# EAGLE schematic ARE_moduls (EAGLE 6.1)

## Sheet 1 of 6: Motor Pololu encoder/driver
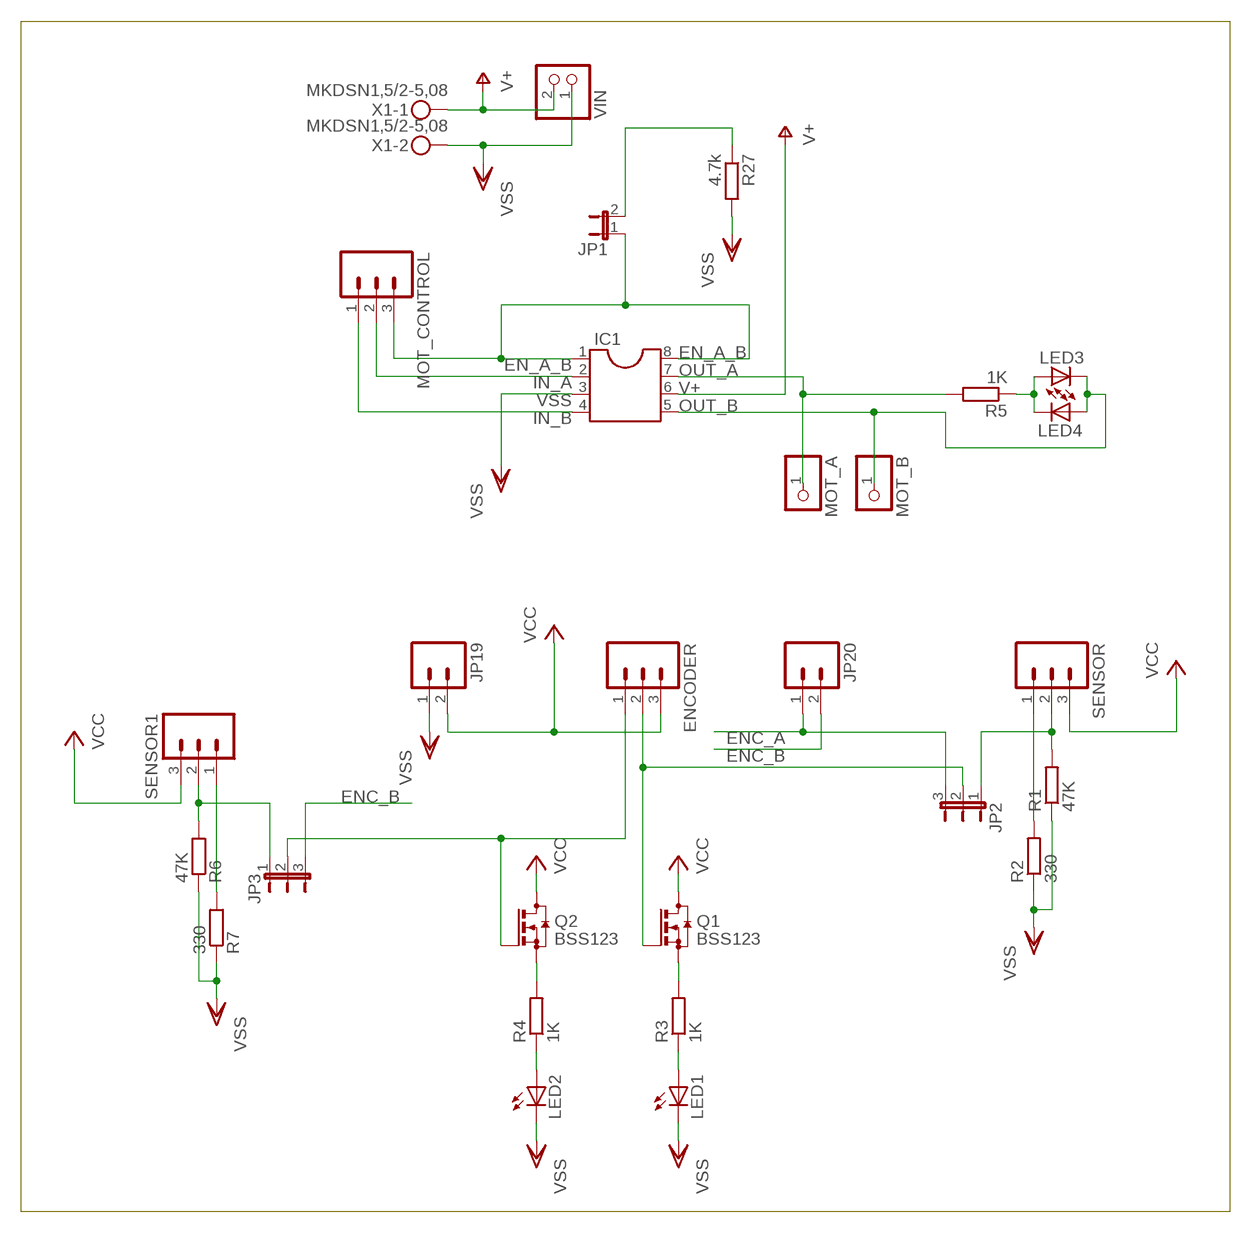
[diagram p0: schematic, sheet 1]

### Parts
ENCODER  M03PTH  [1X03]
IC1  DIL8S  [SOCKET-08]
JP1  JP1E  [JP1]
JP2  JP2E  [JP2]
JP3  JP2E  [JP2]
JP19  M02PTH  [1X02]
JP20  M02PTH  [1X02]
LED1  LEDCHIPLED_0805  [CHIPLED_0805]
LED2  LEDCHIPLED_0805  [CHIPLED_0805]
LED3  LEDCHIPLED_0805  [CHIPLED_0805]
LED4  LEDCHIPLED_0805  [CHIPLED_0805]
MOT_A  PINHD-1X1  [1X01]
MOT_B  PINHD-1X1  [1X01]
MOT_CONTROL  M03PTH  [1X03]
Q1  BSS123  [SOT23]
Q2  BSS123  [SOT23]
R1  47K  R-EU_M0805  [M0805]
R2  330  R-EU_M0805  [M0805]
R3  1K  R-EU_M0805  [M0805]
R4  1K  R-EU_M0805  [M0805]
R5  1K  R-EU_M0805  [M0805]
R6  47K  R-EU_M0805  [M0805]
R7  330  R-EU_M0805  [M0805]
R27  4.7k  R-EU_R0805  [R0805]
SENSOR  M03PTH  [1X03]
SENSOR1  M03PTH  [1X03]
VIN  PINHD-1X2  [1X02]
X1  MKDSN1,5/2-5,08  [MKDSN1,5/2-5,08]

### Nets
EN_A_B: IC1.1 IC1.8 JP1.1 MOT_CONTROL.3
ENC_A: JP2.3 JP20.1
ENC_B: JP3.3 JP20.2
IN_A: IC1.2 MOT_CONTROL.2
IN_B: IC1.4 MOT_CONTROL.1
N$1: JP1.2 R27.1
N$2: R2.2 SENSOR.1
N$3: ENCODER.2 JP2.2 Q1.1(G)
N$4: JP2.1 R1.2 SENSOR.2
N$5: Q1.2(S) R3.2
N$6: LED1.A R3.1
N$7: Q2.2(S) R4.2
N$8: LED2.A R4.1
N$9: LED3.A LED4.C R5.1
N$11: R7.2 SENSOR1.1
N$12: JP3.1 R6.2 SENSOR1.2
N$13: ENCODER.1 JP3.2 Q2.1(G)
OUT_A: IC1.7 MOT_A.1 R5.2
OUT_B: IC1.5 LED3.C LED4.A MOT_B.1
V+: IC1.6 VIN.2 X1.1
VCC: ENCODER.3 JP19.2 Q1.3(D) Q2.3(D) SENSOR1.3 SENSOR.3 ; also sheet 4
VSS: IC1.3 JP19.1 LED1.C LED2.C R1.1 R2.1 R6.1 R7.1 R27.2 VIN.1 X1.2 ; also sheet 2,3,4,5,6

## Sheet 2 of 6: 4x 16 led
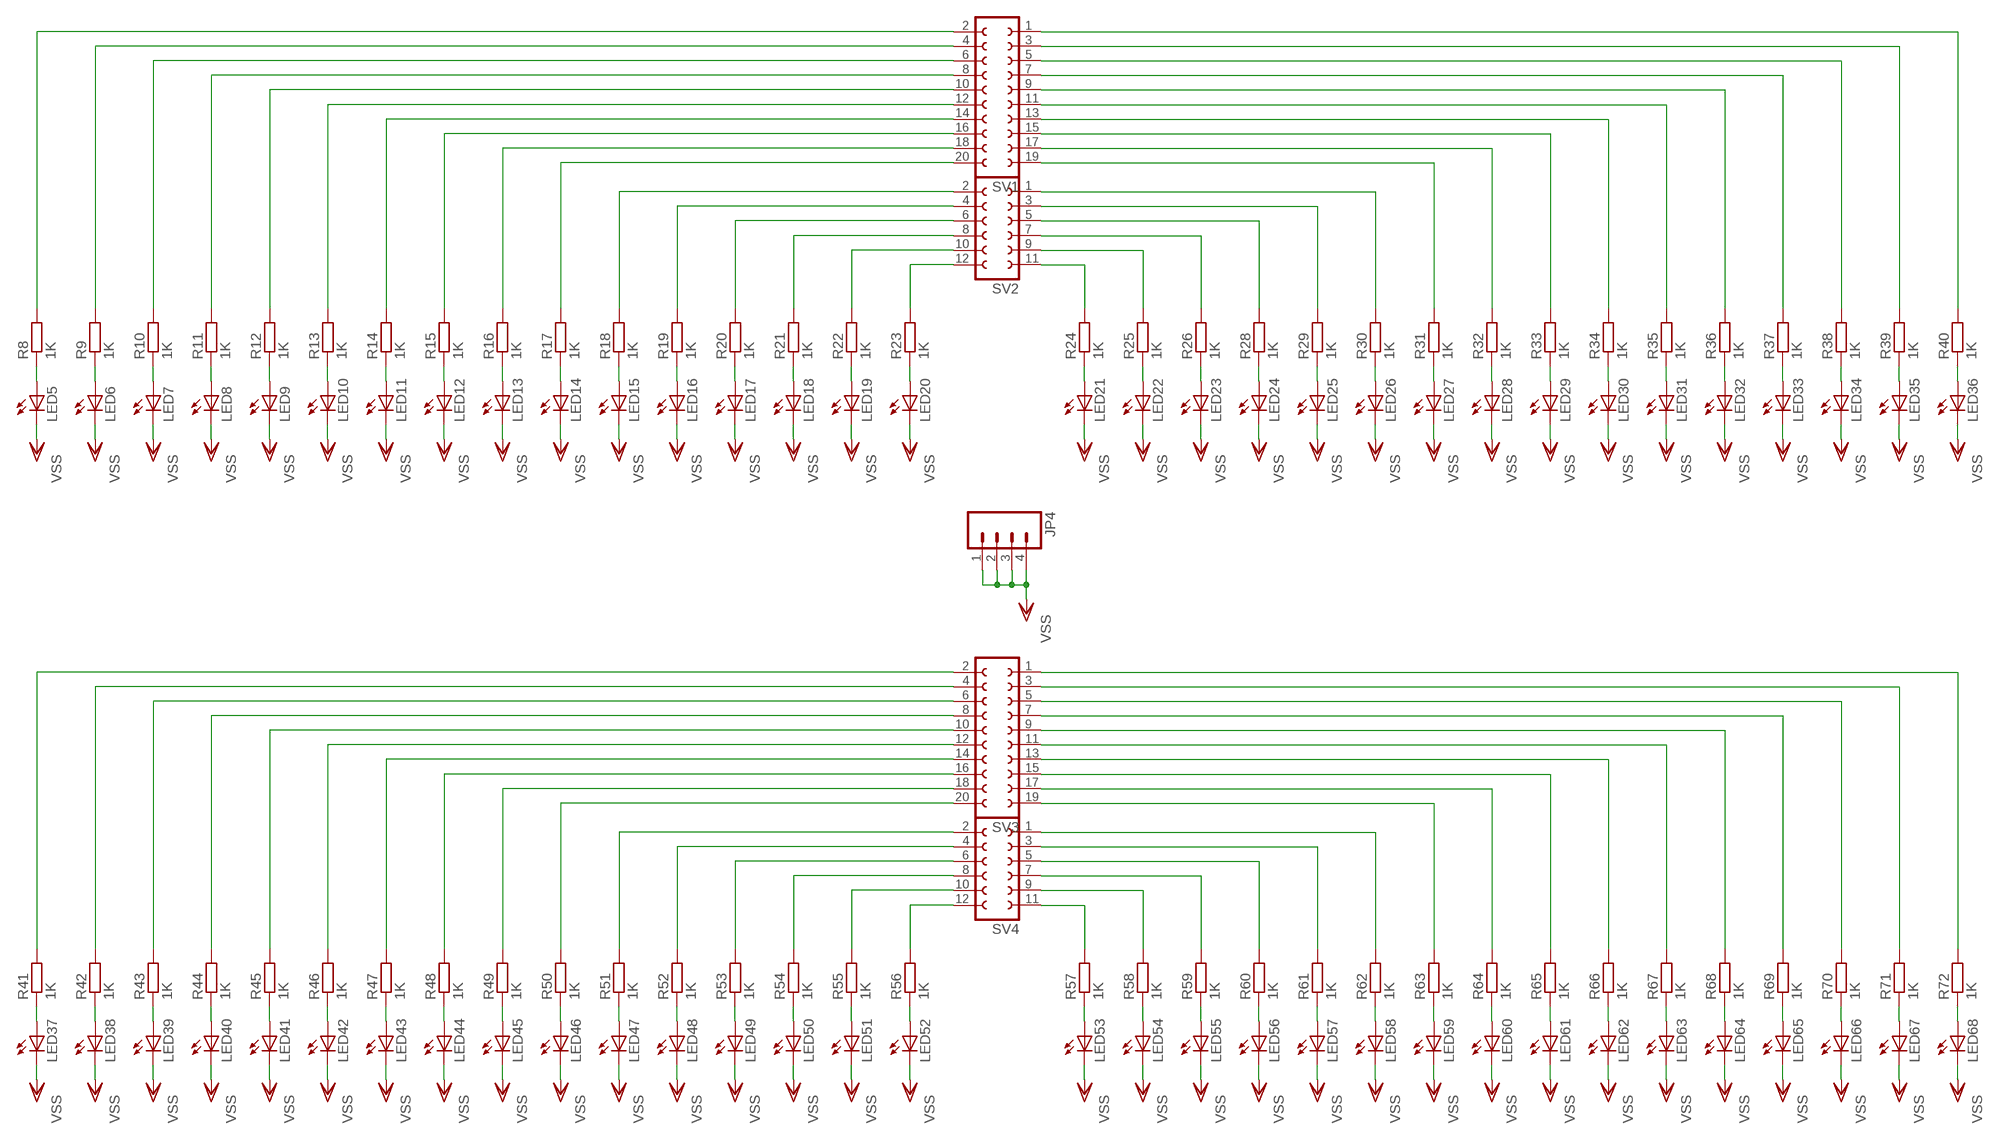
[diagram p1: schematic, sheet 2]

### Parts
JP4  M04PTH  [1X04]
LED5  LEDCHIPLED_0805  [CHIPLED_0805]
LED6  LEDCHIPLED_0805  [CHIPLED_0805]
LED7  LEDCHIPLED_0805  [CHIPLED_0805]
LED8  LEDCHIPLED_0805  [CHIPLED_0805]
LED9  LEDCHIPLED_0805  [CHIPLED_0805]
LED10  LEDCHIPLED_0805  [CHIPLED_0805]
LED11  LEDCHIPLED_0805  [CHIPLED_0805]
LED12  LEDCHIPLED_0805  [CHIPLED_0805]
LED13  LEDCHIPLED_0805  [CHIPLED_0805]
LED14  LEDCHIPLED_0805  [CHIPLED_0805]
LED15  LEDCHIPLED_0805  [CHIPLED_0805]
LED16  LEDCHIPLED_0805  [CHIPLED_0805]
LED17  LEDCHIPLED_0805  [CHIPLED_0805]
LED18  LEDCHIPLED_0805  [CHIPLED_0805]
LED19  LEDCHIPLED_0805  [CHIPLED_0805]
LED20  LEDCHIPLED_0805  [CHIPLED_0805]
LED21  LEDCHIPLED_0805  [CHIPLED_0805]
LED22  LEDCHIPLED_0805  [CHIPLED_0805]
LED23  LEDCHIPLED_0805  [CHIPLED_0805]
LED24  LEDCHIPLED_0805  [CHIPLED_0805]
LED25  LEDCHIPLED_0805  [CHIPLED_0805]
LED26  LEDCHIPLED_0805  [CHIPLED_0805]
LED27  LEDCHIPLED_0805  [CHIPLED_0805]
LED28  LEDCHIPLED_0805  [CHIPLED_0805]
LED29  LEDCHIPLED_0805  [CHIPLED_0805]
LED30  LEDCHIPLED_0805  [CHIPLED_0805]
LED31  LEDCHIPLED_0805  [CHIPLED_0805]
LED32  LEDCHIPLED_0805  [CHIPLED_0805]
LED33  LEDCHIPLED_0805  [CHIPLED_0805]
LED34  LEDCHIPLED_0805  [CHIPLED_0805]
LED35  LEDCHIPLED_0805  [CHIPLED_0805]
LED36  LEDCHIPLED_0805  [CHIPLED_0805]
LED37  LEDCHIPLED_0805  [CHIPLED_0805]
LED38  LEDCHIPLED_0805  [CHIPLED_0805]
LED39  LEDCHIPLED_0805  [CHIPLED_0805]
LED40  LEDCHIPLED_0805  [CHIPLED_0805]
LED41  LEDCHIPLED_0805  [CHIPLED_0805]
LED42  LEDCHIPLED_0805  [CHIPLED_0805]
LED43  LEDCHIPLED_0805  [CHIPLED_0805]
LED44  LEDCHIPLED_0805  [CHIPLED_0805]
LED45  LEDCHIPLED_0805  [CHIPLED_0805]
LED46  LEDCHIPLED_0805  [CHIPLED_0805]
LED47  LEDCHIPLED_0805  [CHIPLED_0805]
LED48  LEDCHIPLED_0805  [CHIPLED_0805]
LED49  LEDCHIPLED_0805  [CHIPLED_0805]
LED50  LEDCHIPLED_0805  [CHIPLED_0805]
LED51  LEDCHIPLED_0805  [CHIPLED_0805]
LED52  LEDCHIPLED_0805  [CHIPLED_0805]
LED53  LEDCHIPLED_0805  [CHIPLED_0805]
LED54  LEDCHIPLED_0805  [CHIPLED_0805]
LED55  LEDCHIPLED_0805  [CHIPLED_0805]
LED56  LEDCHIPLED_0805  [CHIPLED_0805]
LED57  LEDCHIPLED_0805  [CHIPLED_0805]
LED58  LEDCHIPLED_0805  [CHIPLED_0805]
LED59  LEDCHIPLED_0805  [CHIPLED_0805]
LED60  LEDCHIPLED_0805  [CHIPLED_0805]
LED61  LEDCHIPLED_0805  [CHIPLED_0805]
LED62  LEDCHIPLED_0805  [CHIPLED_0805]
LED63  LEDCHIPLED_0805  [CHIPLED_0805]
LED64  LEDCHIPLED_0805  [CHIPLED_0805]
LED65  LEDCHIPLED_0805  [CHIPLED_0805]
LED66  LEDCHIPLED_0805  [CHIPLED_0805]
LED67  LEDCHIPLED_0805  [CHIPLED_0805]
LED68  LEDCHIPLED_0805  [CHIPLED_0805]
R8  1K  R-EU_M0805  [M0805]
R9  1K  R-EU_M0805  [M0805]
R10  1K  R-EU_M0805  [M0805]
R11  1K  R-EU_M0805  [M0805]
R12  1K  R-EU_M0805  [M0805]
R13  1K  R-EU_M0805  [M0805]
R14  1K  R-EU_M0805  [M0805]
R15  1K  R-EU_M0805  [M0805]
R16  1K  R-EU_M0805  [M0805]
R17  1K  R-EU_M0805  [M0805]
R18  1K  R-EU_M0805  [M0805]
R19  1K  R-EU_M0805  [M0805]
R20  1K  R-EU_M0805  [M0805]
R21  1K  R-EU_M0805  [M0805]
R22  1K  R-EU_M0805  [M0805]
R23  1K  R-EU_M0805  [M0805]
R24  1K  R-EU_M0805  [M0805]
R25  1K  R-EU_M0805  [M0805]
R26  1K  R-EU_M0805  [M0805]
R28  1K  R-EU_M0805  [M0805]
R29  1K  R-EU_M0805  [M0805]
R30  1K  R-EU_M0805  [M0805]
R31  1K  R-EU_M0805  [M0805]
R32  1K  R-EU_M0805  [M0805]
R33  1K  R-EU_M0805  [M0805]
R34  1K  R-EU_M0805  [M0805]
R35  1K  R-EU_M0805  [M0805]
R36  1K  R-EU_M0805  [M0805]
R37  1K  R-EU_M0805  [M0805]
R38  1K  R-EU_M0805  [M0805]
R39  1K  R-EU_M0805  [M0805]
R40  1K  R-EU_M0805  [M0805]
R41  1K  R-EU_M0805  [M0805]
R42  1K  R-EU_M0805  [M0805]
R43  1K  R-EU_M0805  [M0805]
R44  1K  R-EU_M0805  [M0805]
R45  1K  R-EU_M0805  [M0805]
R46  1K  R-EU_M0805  [M0805]
R47  1K  R-EU_M0805  [M0805]
R48  1K  R-EU_M0805  [M0805]
R49  1K  R-EU_M0805  [M0805]
R50  1K  R-EU_M0805  [M0805]
R51  1K  R-EU_M0805  [M0805]
R52  1K  R-EU_M0805  [M0805]
R53  1K  R-EU_M0805  [M0805]
R54  1K  R-EU_M0805  [M0805]
R55  1K  R-EU_M0805  [M0805]
R56  1K  R-EU_M0805  [M0805]
R57  1K  R-EU_M0805  [M0805]
R58  1K  R-EU_M0805  [M0805]
R59  1K  R-EU_M0805  [M0805]
R60  1K  R-EU_M0805  [M0805]
R61  1K  R-EU_M0805  [M0805]
R62  1K  R-EU_M0805  [M0805]
R63  1K  R-EU_M0805  [M0805]
R64  1K  R-EU_M0805  [M0805]
R65  1K  R-EU_M0805  [M0805]
R66  1K  R-EU_M0805  [M0805]
R67  1K  R-EU_M0805  [M0805]
R68  1K  R-EU_M0805  [M0805]
R69  1K  R-EU_M0805  [M0805]
R70  1K  R-EU_M0805  [M0805]
R71  1K  R-EU_M0805  [M0805]
R72  1K  R-EU_M0805  [M0805]
SV1  FE10-2  [FE10-2]
SV2  FE06-2  [FE06-2]
SV3  FE10-2  [FE10-2]
SV4  FE06-2  [FE06-2]

### Nets
N$14: LED5.A R8.1
N$15: LED6.A R9.1
N$16: LED7.A R10.1
N$17: LED8.A R11.1
N$18: LED9.A R12.1
N$19: LED10.A R13.1
N$20: LED11.A R14.1
N$21: LED12.A R15.1
N$22: LED13.A R16.1
N$23: LED14.A R17.1
N$24: LED15.A R18.1
N$25: LED16.A R19.1
N$26: LED17.A R20.1
N$27: LED18.A R21.1
N$28: LED19.A R22.1
N$29: LED20.A R23.1
N$30: R23.2 SV2.12
N$31: LED37.A R41.1
N$32: R22.2 SV2.10
N$33: R21.2 SV2.8
N$34: R20.2 SV2.6
N$35: R19.2 SV2.4
N$36: R18.2 SV2.2
N$37: R17.2 SV1.20
N$38: R16.2 SV1.18
N$39: R15.2 SV1.16
N$40: R14.2 SV1.14
N$41: R13.2 SV1.12
N$42: R12.2 SV1.10
N$43: R11.2 SV1.8
N$44: R10.2 SV1.6
N$45: R9.2 SV1.4
N$46: R8.2 SV1.2
N$47: LED21.A R24.1
N$48: LED22.A R25.1
N$49: LED23.A R26.1
N$50: LED24.A R28.1
N$51: LED25.A R29.1
N$52: LED26.A R30.1
N$53: LED27.A R31.1
N$54: LED28.A R32.1
N$56: LED29.A R33.1
N$57: LED30.A R34.1
N$58: LED31.A R35.1
N$59: LED32.A R36.1
N$60: LED33.A R37.1
N$61: LED34.A R38.1
N$62: LED35.A R39.1
N$63: LED36.A R40.1
N$64: R24.2 SV2.11
N$65: R25.2 SV2.9
N$66: R26.2 SV2.7
N$67: R28.2 SV2.5
N$68: R29.2 SV2.3
N$69: R30.2 SV2.1
N$70: R31.2 SV1.19
N$71: R32.2 SV1.17
N$72: R33.2 SV1.15
N$73: R34.2 SV1.13
N$74: R35.2 SV1.11
N$75: R36.2 SV1.9
N$76: R37.2 SV1.7
N$77: R38.2 SV1.5
N$78: R39.2 SV1.3
N$79: R40.2 SV1.1
N$80: LED38.A R42.1
N$81: LED39.A R43.1
N$82: LED40.A R44.1
N$83: LED41.A R45.1
N$84: LED42.A R46.1
N$85: LED43.A R47.1
N$86: LED44.A R48.1
N$87: LED45.A R49.1
N$88: LED46.A R50.1
N$89: LED47.A R51.1
N$90: LED48.A R52.1
N$91: LED49.A R53.1
N$92: LED50.A R54.1
N$93: LED51.A R55.1
N$94: LED52.A R56.1
N$95: R56.2 SV4.12
N$96: R55.2 SV4.10
N$97: R54.2 SV4.8
N$98: R53.2 SV4.6
N$99: R52.2 SV4.4
N$100: R51.2 SV4.2
N$101: R50.2 SV3.20
N$102: R49.2 SV3.18
N$103: R48.2 SV3.16
N$104: R47.2 SV3.14
N$105: R46.2 SV3.12
N$106: R45.2 SV3.10
N$107: R44.2 SV3.8
N$108: R43.2 SV3.6
N$109: R42.2 SV3.4
N$110: R41.2 SV3.2
N$111: LED53.A R57.1
N$112: LED54.A R58.1
N$113: LED55.A R59.1
N$114: LED56.A R60.1
N$115: LED57.A R61.1
N$116: LED58.A R62.1
N$117: LED59.A R63.1
N$118: LED60.A R64.1
N$119: LED61.A R65.1
N$120: LED62.A R66.1
N$121: LED63.A R67.1
N$122: LED64.A R68.1
N$123: LED65.A R69.1
N$124: LED66.A R70.1
N$125: LED67.A R71.1
N$126: LED68.A R72.1
N$127: R57.2 SV4.11
N$128: R58.2 SV4.9
N$132: R59.2 SV4.7
N$133: R60.2 SV4.5
N$134: R61.2 SV4.3
N$135: R62.2 SV4.1
N$136: R63.2 SV3.19
N$137: R64.2 SV3.17
N$138: R65.2 SV3.15
N$139: R66.2 SV3.13
N$140: R67.2 SV3.11
N$141: R68.2 SV3.9
N$142: R69.2 SV3.7
N$143: R70.2 SV3.5
N$144: R71.2 SV3.3
N$145: R72.2 SV3.1
VSS: JP4.1 JP4.2 JP4.3 JP4.4 LED5.C LED6.C LED7.C LED8.C LED9.C LED10.C LED11.C LED12.C LED13.C LED14.C LED15.C LED16.C LED17.C LED18.C LED19.C LED20.C LED21.C LED22.C LED23.C LED24.C LED25.C LED26.C LED27.C LED28.C LED29.C LED30.C LED31.C LED32.C LED33.C LED34.C LED35.C LED36.C LED37.C LED38.C LED39.C LED40.C LED41.C LED42.C LED43.C LED44.C LED45.C LED46.C LED47.C LED48.C LED49.C LED50.C LED51.C LED52.C LED53.C LED54.C LED55.C LED56.C LED57.C LED58.C LED59.C LED60.C LED61.C LED62.C LED63.C LED64.C LED65.C LED66.C LED67.C LED68.C ; also sheet 1,3,4,5,6

## Sheet 3 of 6: 3x 16 led
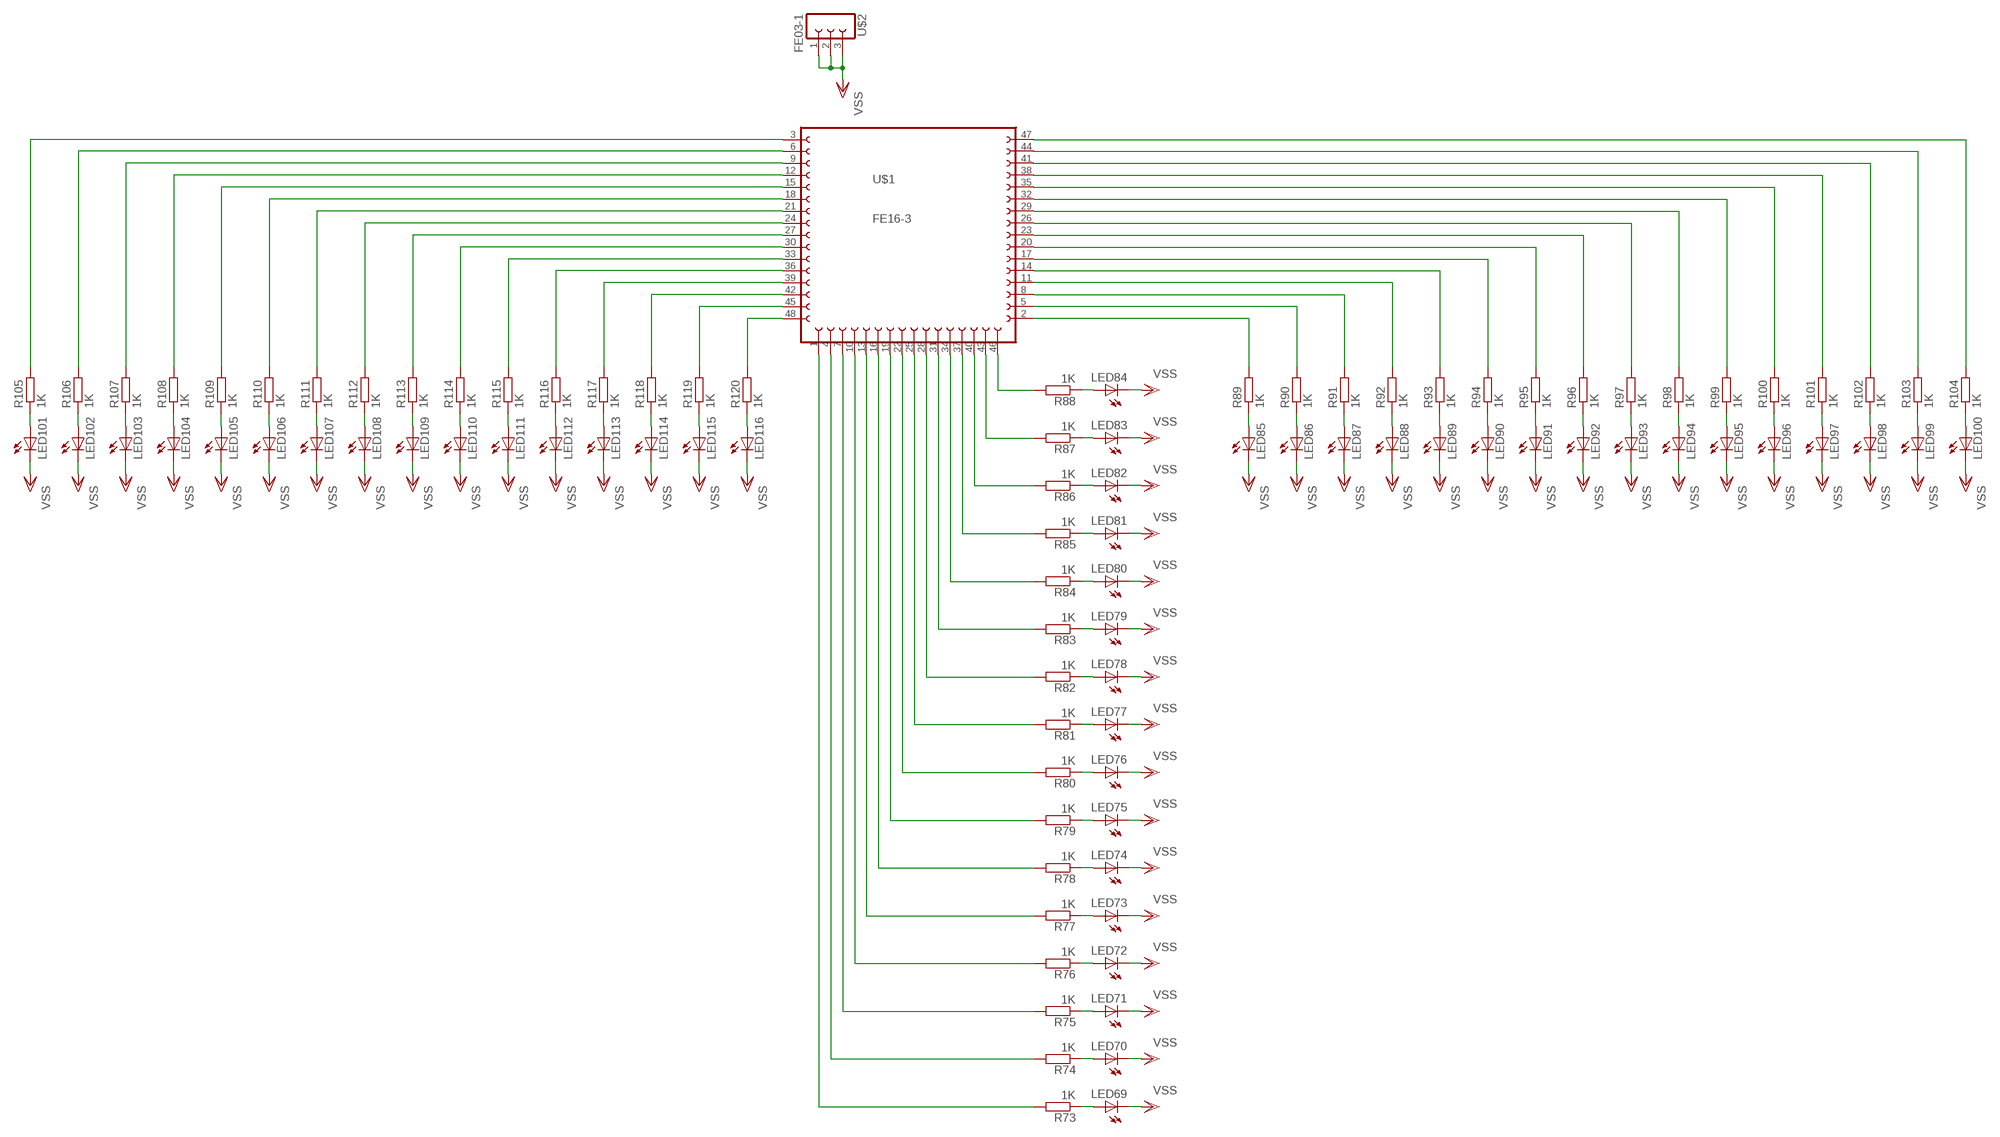
[diagram p2: schematic, sheet 3]

### Parts
LED69  LEDCHIPLED_0805  [CHIPLED_0805]
LED70  LEDCHIPLED_0805  [CHIPLED_0805]
LED71  LEDCHIPLED_0805  [CHIPLED_0805]
LED72  LEDCHIPLED_0805  [CHIPLED_0805]
LED73  LEDCHIPLED_0805  [CHIPLED_0805]
LED74  LEDCHIPLED_0805  [CHIPLED_0805]
LED75  LEDCHIPLED_0805  [CHIPLED_0805]
LED76  LEDCHIPLED_0805  [CHIPLED_0805]
LED77  LEDCHIPLED_0805  [CHIPLED_0805]
LED78  LEDCHIPLED_0805  [CHIPLED_0805]
LED79  LEDCHIPLED_0805  [CHIPLED_0805]
LED80  LEDCHIPLED_0805  [CHIPLED_0805]
LED81  LEDCHIPLED_0805  [CHIPLED_0805]
LED82  LEDCHIPLED_0805  [CHIPLED_0805]
LED83  LEDCHIPLED_0805  [CHIPLED_0805]
LED84  LEDCHIPLED_0805  [CHIPLED_0805]
LED85  LEDCHIPLED_0805  [CHIPLED_0805]
LED86  LEDCHIPLED_0805  [CHIPLED_0805]
LED87  LEDCHIPLED_0805  [CHIPLED_0805]
LED88  LEDCHIPLED_0805  [CHIPLED_0805]
LED89  LEDCHIPLED_0805  [CHIPLED_0805]
LED90  LEDCHIPLED_0805  [CHIPLED_0805]
LED91  LEDCHIPLED_0805  [CHIPLED_0805]
LED92  LEDCHIPLED_0805  [CHIPLED_0805]
LED93  LEDCHIPLED_0805  [CHIPLED_0805]
LED94  LEDCHIPLED_0805  [CHIPLED_0805]
LED95  LEDCHIPLED_0805  [CHIPLED_0805]
LED96  LEDCHIPLED_0805  [CHIPLED_0805]
LED97  LEDCHIPLED_0805  [CHIPLED_0805]
LED98  LEDCHIPLED_0805  [CHIPLED_0805]
LED99  LEDCHIPLED_0805  [CHIPLED_0805]
LED100  LEDCHIPLED_0805  [CHIPLED_0805]
LED101  LEDCHIPLED_0805  [CHIPLED_0805]
LED102  LEDCHIPLED_0805  [CHIPLED_0805]
LED103  LEDCHIPLED_0805  [CHIPLED_0805]
LED104  LEDCHIPLED_0805  [CHIPLED_0805]
LED105  LEDCHIPLED_0805  [CHIPLED_0805]
LED106  LEDCHIPLED_0805  [CHIPLED_0805]
LED107  LEDCHIPLED_0805  [CHIPLED_0805]
LED108  LEDCHIPLED_0805  [CHIPLED_0805]
LED109  LEDCHIPLED_0805  [CHIPLED_0805]
LED110  LEDCHIPLED_0805  [CHIPLED_0805]
LED111  LEDCHIPLED_0805  [CHIPLED_0805]
LED112  LEDCHIPLED_0805  [CHIPLED_0805]
LED113  LEDCHIPLED_0805  [CHIPLED_0805]
LED114  LEDCHIPLED_0805  [CHIPLED_0805]
LED115  LEDCHIPLED_0805  [CHIPLED_0805]
LED116  LEDCHIPLED_0805  [CHIPLED_0805]
R73  1K  R-EU_M0805  [M0805]
R74  1K  R-EU_M0805  [M0805]
R75  1K  R-EU_M0805  [M0805]
R76  1K  R-EU_M0805  [M0805]
R77  1K  R-EU_M0805  [M0805]
R78  1K  R-EU_M0805  [M0805]
R79  1K  R-EU_M0805  [M0805]
R80  1K  R-EU_M0805  [M0805]
R81  1K  R-EU_M0805  [M0805]
R82  1K  R-EU_M0805  [M0805]
R83  1K  R-EU_M0805  [M0805]
R84  1K  R-EU_M0805  [M0805]
R85  1K  R-EU_M0805  [M0805]
R86  1K  R-EU_M0805  [M0805]
R87  1K  R-EU_M0805  [M0805]
R88  1K  R-EU_M0805  [M0805]
R89  1K  R-EU_M0805  [M0805]
R90  1K  R-EU_M0805  [M0805]
R91  1K  R-EU_M0805  [M0805]
R92  1K  R-EU_M0805  [M0805]
R93  1K  R-EU_M0805  [M0805]
R94  1K  R-EU_M0805  [M0805]
R95  1K  R-EU_M0805  [M0805]
R96  1K  R-EU_M0805  [M0805]
R97  1K  R-EU_M0805  [M0805]
R98  1K  R-EU_M0805  [M0805]
R99  1K  R-EU_M0805  [M0805]
R100  1K  R-EU_M0805  [M0805]
R101  1K  R-EU_M0805  [M0805]
R102  1K  R-EU_M0805  [M0805]
R103  1K  R-EU_M0805  [M0805]
R104  1K  R-EU_M0805  [M0805]
R105  1K  R-EU_M0805  [M0805]
R106  1K  R-EU_M0805  [M0805]
R107  1K  R-EU_M0805  [M0805]
R108  1K  R-EU_M0805  [M0805]
R109  1K  R-EU_M0805  [M0805]
R110  1K  R-EU_M0805  [M0805]
R111  1K  R-EU_M0805  [M0805]
R112  1K  R-EU_M0805  [M0805]
R113  1K  R-EU_M0805  [M0805]
R114  1K  R-EU_M0805  [M0805]
R115  1K  R-EU_M0805  [M0805]
R116  1K  R-EU_M0805  [M0805]
R117  1K  R-EU_M0805  [M0805]
R118  1K  R-EU_M0805  [M0805]
R119  1K  R-EU_M0805  [M0805]
R120  1K  R-EU_M0805  [M0805]
U$1  FE16-3  [FE16-3]
U$2  FE03-1  [FE03-1]

### Nets
N$146: LED69.A R73.1
N$147: LED70.A R74.1
N$148: LED71.A R75.1
N$149: LED72.A R76.1
N$150: LED73.A R77.1
N$151: LED74.A R78.1
N$152: LED75.A R79.1
N$153: LED76.A R80.1
N$154: LED77.A R81.1
N$155: LED78.A R82.1
N$156: LED79.A R83.1
N$157: LED80.A R84.1
N$158: LED81.A R85.1
N$159: LED82.A R86.1
N$160: LED83.A R87.1
N$161: LED84.A R88.1
N$162: R88.2 U$1.46
N$163: R87.2 U$1.43
N$164: R86.2 U$1.40
N$165: R85.2 U$1.37
N$166: R84.2 U$1.34
N$167: R83.2 U$1.31
N$168: R82.2 U$1.28
N$169: R81.2 U$1.25
N$170: R80.2 U$1.22
N$171: R79.2 U$1.19
N$172: R78.2 U$1.16
N$173: R77.2 U$1.13
N$174: R76.2 U$1.10
N$175: R75.2 U$1.7
N$176: R74.2 U$1.4
N$177: R73.2 U$1.1
N$178: LED85.A R89.1
N$179: LED86.A R90.1
N$180: LED87.A R91.1
N$181: LED88.A R92.1
N$182: LED89.A R93.1
N$183: LED90.A R94.1
N$184: LED91.A R95.1
N$185: LED92.A R96.1
N$186: LED93.A R97.1
N$187: LED94.A R98.1
N$188: LED95.A R99.1
N$189: LED96.A R100.1
N$190: LED97.A R101.1
N$191: LED98.A R102.1
N$192: LED99.A R103.1
N$193: LED100.A R104.1
N$194: R89.2 U$1.2
N$195: R90.2 U$1.5
N$196: R91.2 U$1.8
N$197: R92.2 U$1.11
N$198: R93.2 U$1.14
N$199: R94.2 U$1.17
N$200: R95.2 U$1.20
N$201: R96.2 U$1.23
N$202: R97.2 U$1.26
N$203: R98.2 U$1.29
N$204: R99.2 U$1.32
N$205: R100.2 U$1.35
N$206: R101.2 U$1.38
N$207: R102.2 U$1.41
N$208: R103.2 U$1.44
N$209: R104.2 U$1.47
N$210: LED101.A R105.1
N$211: LED102.A R106.1
N$212: LED103.A R107.1
N$213: LED104.A R108.1
N$214: LED105.A R109.1
N$215: LED106.A R110.1
N$216: LED107.A R111.1
N$217: LED108.A R112.1
N$218: LED109.A R113.1
N$219: LED110.A R114.1
N$220: LED111.A R115.1
N$221: LED112.A R116.1
N$222: LED113.A R117.1
N$223: LED114.A R118.1
N$224: LED115.A R119.1
N$225: LED116.A R120.1
N$226: R120.2 U$1.48
N$227: R119.2 U$1.45
N$228: R118.2 U$1.42
N$229: R117.2 U$1.39
N$230: R116.2 U$1.36
N$231: R115.2 U$1.33
N$232: R114.2 U$1.30
N$233: R113.2 U$1.27
N$234: R112.2 U$1.24
N$235: R111.2 U$1.21
N$236: R110.2 U$1.18
N$237: R109.2 U$1.15
N$238: R108.2 U$1.12
N$239: R107.2 U$1.9
N$240: R106.2 U$1.6
N$241: R105.2 U$1.3
VSS: LED69.C LED70.C LED71.C LED72.C LED73.C LED74.C LED75.C LED76.C LED77.C LED78.C LED79.C LED80.C LED81.C LED82.C LED83.C LED84.C LED85.C LED86.C LED87.C LED88.C LED89.C LED90.C LED91.C LED92.C LED93.C LED94.C LED95.C LED96.C LED97.C LED98.C LED99.C LED100.C LED101.C LED102.C LED103.C LED104.C LED105.C LED106.C LED107.C LED108.C LED109.C LED110.C LED111.C LED112.C LED113.C LED114.C LED115.C LED116.C U$2.1 U$2.2 U$2.3 ; also sheet 1,2,4,5,6

## Sheet 4 of 6: 2x 16 led + 16 dip-switch
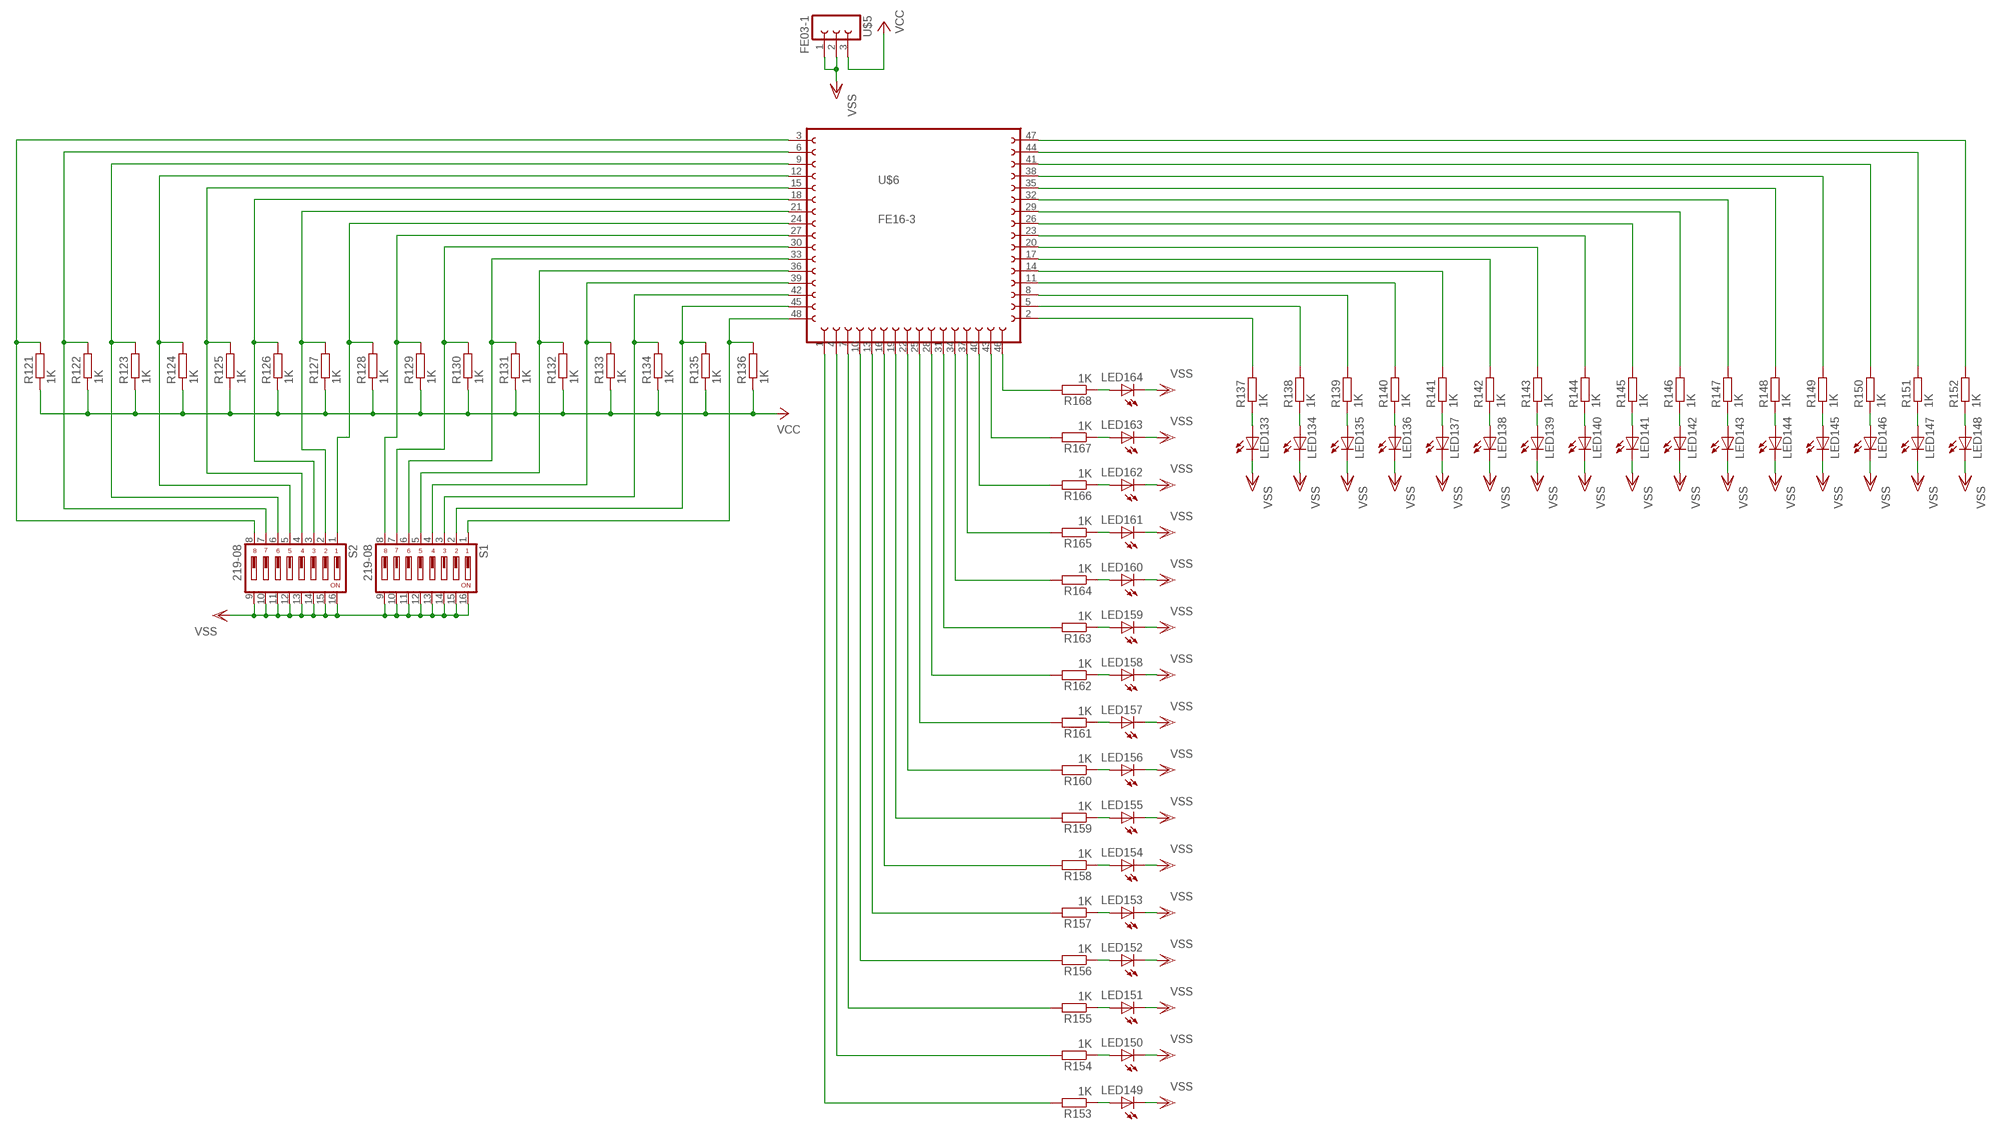
[diagram p3: schematic, sheet 4]

### Parts
LED133  LEDCHIPLED_0805  [CHIPLED_0805]
LED134  LEDCHIPLED_0805  [CHIPLED_0805]
LED135  LEDCHIPLED_0805  [CHIPLED_0805]
LED136  LEDCHIPLED_0805  [CHIPLED_0805]
LED137  LEDCHIPLED_0805  [CHIPLED_0805]
LED138  LEDCHIPLED_0805  [CHIPLED_0805]
LED139  LEDCHIPLED_0805  [CHIPLED_0805]
LED140  LEDCHIPLED_0805  [CHIPLED_0805]
LED141  LEDCHIPLED_0805  [CHIPLED_0805]
LED142  LEDCHIPLED_0805  [CHIPLED_0805]
LED143  LEDCHIPLED_0805  [CHIPLED_0805]
LED144  LEDCHIPLED_0805  [CHIPLED_0805]
LED145  LEDCHIPLED_0805  [CHIPLED_0805]
LED146  LEDCHIPLED_0805  [CHIPLED_0805]
LED147  LEDCHIPLED_0805  [CHIPLED_0805]
LED148  LEDCHIPLED_0805  [CHIPLED_0805]
LED149  LEDCHIPLED_0805  [CHIPLED_0805]
LED150  LEDCHIPLED_0805  [CHIPLED_0805]
LED151  LEDCHIPLED_0805  [CHIPLED_0805]
LED152  LEDCHIPLED_0805  [CHIPLED_0805]
LED153  LEDCHIPLED_0805  [CHIPLED_0805]
LED154  LEDCHIPLED_0805  [CHIPLED_0805]
LED155  LEDCHIPLED_0805  [CHIPLED_0805]
LED156  LEDCHIPLED_0805  [CHIPLED_0805]
LED157  LEDCHIPLED_0805  [CHIPLED_0805]
LED158  LEDCHIPLED_0805  [CHIPLED_0805]
LED159  LEDCHIPLED_0805  [CHIPLED_0805]
LED160  LEDCHIPLED_0805  [CHIPLED_0805]
LED161  LEDCHIPLED_0805  [CHIPLED_0805]
LED162  LEDCHIPLED_0805  [CHIPLED_0805]
LED163  LEDCHIPLED_0805  [CHIPLED_0805]
LED164  LEDCHIPLED_0805  [CHIPLED_0805]
R121  1K  R-EU_M0805  [M0805]
R122  1K  R-EU_M0805  [M0805]
R123  1K  R-EU_M0805  [M0805]
R124  1K  R-EU_M0805  [M0805]
R125  1K  R-EU_M0805  [M0805]
R126  1K  R-EU_M0805  [M0805]
R127  1K  R-EU_M0805  [M0805]
R128  1K  R-EU_M0805  [M0805]
R129  1K  R-EU_M0805  [M0805]
R130  1K  R-EU_M0805  [M0805]
R131  1K  R-EU_M0805  [M0805]
R132  1K  R-EU_M0805  [M0805]
R133  1K  R-EU_M0805  [M0805]
R134  1K  R-EU_M0805  [M0805]
R135  1K  R-EU_M0805  [M0805]
R136  1K  R-EU_M0805  [M0805]
R137  1K  R-EU_M0805  [M0805]
R138  1K  R-EU_M0805  [M0805]
R139  1K  R-EU_M0805  [M0805]
R140  1K  R-EU_M0805  [M0805]
R141  1K  R-EU_M0805  [M0805]
R142  1K  R-EU_M0805  [M0805]
R143  1K  R-EU_M0805  [M0805]
R144  1K  R-EU_M0805  [M0805]
R145  1K  R-EU_M0805  [M0805]
R146  1K  R-EU_M0805  [M0805]
R147  1K  R-EU_M0805  [M0805]
R148  1K  R-EU_M0805  [M0805]
R149  1K  R-EU_M0805  [M0805]
R150  1K  R-EU_M0805  [M0805]
R151  1K  R-EU_M0805  [M0805]
R152  1K  R-EU_M0805  [M0805]
R153  1K  R-EU_M0805  [M0805]
R154  1K  R-EU_M0805  [M0805]
R155  1K  R-EU_M0805  [M0805]
R156  1K  R-EU_M0805  [M0805]
R157  1K  R-EU_M0805  [M0805]
R158  1K  R-EU_M0805  [M0805]
R159  1K  R-EU_M0805  [M0805]
R160  1K  R-EU_M0805  [M0805]
R161  1K  R-EU_M0805  [M0805]
R162  1K  R-EU_M0805  [M0805]
R163  1K  R-EU_M0805  [M0805]
R164  1K  R-EU_M0805  [M0805]
R165  1K  R-EU_M0805  [M0805]
R166  1K  R-EU_M0805  [M0805]
R167  1K  R-EU_M0805  [M0805]
R168  1K  R-EU_M0805  [M0805]
S1  219-08  [CTS-219-08]
S2  219-08  [CTS-219-08]
U$5  FE03-1  [FE03-1]
U$6  FE16-3  [FE16-3]

### Nets
N$242: R135.2 S1.2 U$6.45
N$243: R136.2 S1.1 U$6.48
N$244: R134.2 S1.3 U$6.42
N$245: R133.2 S1.4 U$6.39
N$246: R132.2 S1.5 U$6.36
N$247: R131.2 S1.6 U$6.33
N$248: R130.2 S1.7 U$6.30
N$249: R129.2 S1.8 U$6.27
N$250: R128.2 S2.1 U$6.24
N$251: R127.2 S2.2 U$6.21
N$252: R126.2 S2.3 U$6.18
N$253: R125.2 S2.4 U$6.15
N$254: R124.2 S2.5 U$6.12
N$255: R123.2 S2.6 U$6.9
N$256: R122.2 S2.7 U$6.6
N$257: R121.2 S2.8 U$6.3
N$274: LED133.A R137.1
N$275: LED134.A R138.1
N$276: LED135.A R139.1
N$277: LED136.A R140.1
N$278: LED137.A R141.1
N$279: LED138.A R142.1
N$280: LED139.A R143.1
N$281: LED140.A R144.1
N$282: LED141.A R145.1
N$283: LED142.A R146.1
N$284: LED143.A R147.1
N$285: LED144.A R148.1
N$286: LED145.A R149.1
N$287: LED146.A R150.1
N$288: LED147.A R151.1
N$289: LED148.A R152.1
N$290: R137.2 U$6.2
N$291: R138.2 U$6.5
N$292: R139.2 U$6.8
N$293: R140.2 U$6.11
N$294: R141.2 U$6.14
N$295: R142.2 U$6.17
N$296: R143.2 U$6.20
N$297: R144.2 U$6.23
N$298: R145.2 U$6.26
N$299: R146.2 U$6.29
N$300: R147.2 U$6.32
N$301: R148.2 U$6.35
N$302: R149.2 U$6.38
N$303: R150.2 U$6.41
N$304: R151.2 U$6.44
N$305: R152.2 U$6.47
N$306: LED149.A R153.1
N$307: LED150.A R154.1
N$308: LED151.A R155.1
N$309: LED152.A R156.1
N$310: LED153.A R157.1
N$311: LED154.A R158.1
N$312: LED155.A R159.1
N$313: LED156.A R160.1
N$314: LED157.A R161.1
N$315: LED158.A R162.1
N$316: LED159.A R163.1
N$317: LED160.A R164.1
N$318: LED161.A R165.1
N$319: LED162.A R166.1
N$320: LED163.A R167.1
N$321: LED164.A R168.1
N$322: R168.2 U$6.46
N$323: R167.2 U$6.43
N$324: R166.2 U$6.40
N$325: R165.2 U$6.37
N$326: R164.2 U$6.34
N$327: R163.2 U$6.31
N$328: R162.2 U$6.28
N$329: R161.2 U$6.25
N$330: R160.2 U$6.22
N$331: R159.2 U$6.19
N$332: R158.2 U$6.16
N$333: R157.2 U$6.13
N$334: R156.2 U$6.10
N$335: R155.2 U$6.7
N$336: R154.2 U$6.4
N$337: R153.2 U$6.1
VCC: R121.1 R122.1 R123.1 R124.1 R125.1 R126.1 R127.1 R128.1 R129.1 R130.1 R131.1 R132.1 R133.1 R134.1 R135.1 R136.1 U$5.3 ; also sheet 1
VSS: LED133.C LED134.C LED135.C LED136.C LED137.C LED138.C LED139.C LED140.C LED141.C LED142.C LED143.C LED144.C LED145.C LED146.C LED147.C LED148.C LED149.C LED150.C LED151.C LED152.C LED153.C LED154.C LED155.C LED156.C LED157.C LED158.C LED159.C LED160.C LED161.C LED162.C LED163.C LED164.C S1.9 S1.10 S1.11 S1.12 S1.13 S1.14 S1.15 S1.16 S2.9 S2.10 S2.11 S2.12 S2.13 S2.14 S2.15 S2.16 U$5.1 U$5.2 ; also sheet 1,2,3,5,6

## Sheet 5 of 6: Adaptador Click
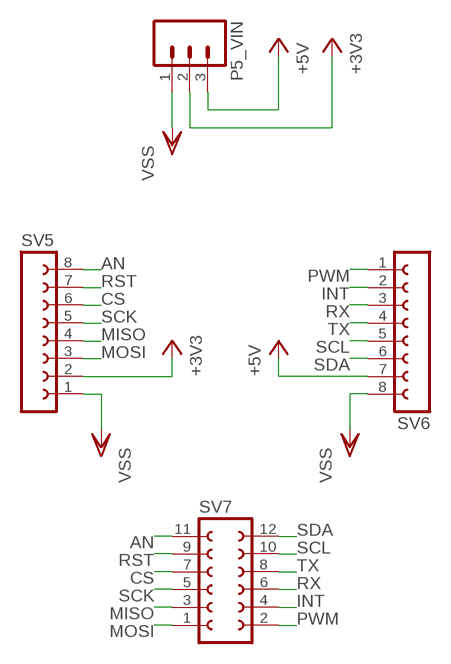
[diagram p4: schematic, sheet 5]

### Parts
P5_VIN  M03PTH  [1X03]
SV5  FE08-1  [FE08]
SV6  FE08-1  [FE08]
SV7  FE06-2  [FE06-2]

### Nets
+3V3: P5_VIN.2 SV5.2 ; also sheet 6
+5V: P5_VIN.3 SV6.7 ; also sheet 6
AN: SV5.8 SV7.11
CS: SV5.6 SV7.7
INT: SV6.2 SV7.4
MISO: SV5.4 SV7.3
MOSI: SV5.3 SV7.1
PWM: SV6.1 SV7.2
RST: SV5.7 SV7.9
RX: SV6.3 SV7.6
SCK: SV5.5 SV7.5
SCL: SV6.5 SV7.10
SDA: SV6.6 SV7.12
TX: SV6.4 SV7.8
VSS: P5_VIN.1 SV5.1 SV6.8 ; also sheet 1,2,3,4,6

## Sheet 6 of 6: Arduino Shield
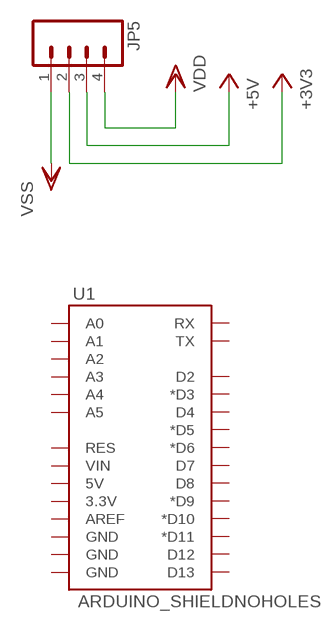
[diagram p5: schematic, sheet 6]

### Parts
JP5  M04PTH  [1X04]
U1  ARDUINO_SHIELDNOHOLES  [DUEMILANOVE_SHIELD_NOHOLES]

### Nets
+3V3: JP5.2 ; also sheet 5
+5V: JP5.3 ; also sheet 5
VDD: JP5.4
VSS: JP5.1 ; also sheet 1,2,3,4,5
Unconnected: U1.3.3V U1.5V U1.A0 U1.A1 U1.A2 U1.A3 U1.A4 U1.A5 U1.AREF U1.D2 U1.D3(*D3) U1.D4 U1.D5(*D5) U1.D6(*D6) U1.D7 U1.D8 U1.D9(*D9) U1.D10(*D10) U1.D11(*D11) U1.D12 U1.D13 U1.GND@0(GND) U1.GND@1(GND) U1.GND@2(GND) U1.RES U1.RX U1.TX U1.VIN

## Library data of the parts
ENCODER MOT_CONTROL P5_VIN SENSOR SENSOR1 = SparkFun:M03: Header 3 Standard 3-pin 0.1" header. Use with straight break away headers (SKU : PRT-00116), right angle break away headers (PRT-00553), swiss pins (PRT-00743), machine pins (PRT-00117), and female headers (PRT-00115). Molex polarized connector foot print use with SKU : PRT-08232 with associated crimp pins and housings.
IC1 = ic-package:DIL8: Dual In Line / Socket
JP1 = jumper:JP1E: JUMPER
JP2 JP3 = jumper:JP2E: JUMPER
JP4 JP5 = SparkFun-Connectors:M04: Header 4 Standard 4-pin 0.1" header. Use with straight break away headers (SKU : PRT-00116), right angle break away headers (PRT-00553), swiss pins (PRT-00743), machine pins (PRT-00117), and female headers (PRT-00115). Molex polarized connector foot print use with SKU : PRT-08231 with associated crimp pins and housings. 1MM SMD Version SKU: PRT-10208
JP19 JP20 = SparkFun:M02: Header 2 Standard 2-pin 0.1" header. Use with straight break away headers (SKU : PRT-00116), right angle break away headers (PRT-00553), swiss pins (PRT-00743), machine pins (PRT-00117), and female headers (PRT-00115). Molex polarized connector foot print use with SKU : PRT-08233 with associated crimp pins and housings.
LED1-LED116 LED133-LED164 = led:LED: LED OSRAM: - CHIPLED LG R971, LG N971, LY N971, LG Q971, LY Q971, LO R971, LY R971 LH N974, LH R974 LS Q976, LO Q976, LY Q976 LO Q996 - Hyper CHIPLED LW Q18S LB Q993, LB Q99A, LB R99A - SideLED LS A670, LO A670, LY A670, LG A670, LP A670 LB A673, LV A673, LT A673, LW A673 LH A674 LY A675 LS A676, LA A676, LO A676, LY A676, LW A676 LS A679, LY A679, LG A679 - Hyper Micro SIDELED® LS Y876, LA Y876, LO Y876, LY Y876 LT Y87S - SmartLED LW L88C, LW L88S LB L89C, LB L89S, LG L890 LS L89K, LO L89K, LY L89K LS L896, LA L896, LO L896, LY L896 - TOPLED LS T670, LO T670, LY T670, LG T670, LP T670 LSG T670, LSP T670, LSY T670, LOP T670, LYG T670 LG T671, LOG T671, LSG T671 LB T673, LV T673, LT T673, LW T673 LH T674 LS T676, LA T676, LO T676, LY T676, LB T676, LH T676, LSB T676, LW T676 LB T67C, LV T67C, LT T67C, LS T67K, LO T67K, LY T67K, LW E67C LS E67B, LA E67B, LO E67B, LY E67B, LB E67C, LV E67C, LT E67C LW T67C LS T679, LY T679, LG T679 LS T770, LO T770, LY T770, LG T770, LP T770 LB T773, LV T773, LT T773, LW T773 LH T774 LS E675, LA E675, LY E675, LS T675 LS T776, LA T776, LO T776, LY T776, LB T776 LHGB T686 LT T68C, LB T68C - Hyper Mini TOPLED® LB M676 - Mini TOPLED Santana® LG M470 LS M47K, LO M47K, LY M47K Source: http://www.osram.convergy.de LUXEON: - LUMILED® LXK2-PW12-R00, LXK2-PW12-S00, LXK2-PW14-U00, LXK2-PW14-V00 LXK2-PM12-R00, LXK2-PM12-S00, LXK2-PM14-U00 LXK2-PE12-Q00, LXK2-PE12-R00, LXK2-PE12-S00, LXK2-PE14-T00, LXK2-PE14-U00 LXK2-PB12-K00, LXK2-PB12-L00, LXK2-PB12-M00, LXK2-PB14-N00, LXK2-PB14-P00, LXK2-PB14-Q00 LXK2-PR12-L00, LXK2-PR12-M00, LXK2-PR14-Q00, LXK2-PR14-R00 LXK2-PD12-Q00, LXK2-PD12-R00, LXK2-PD12-S00 LXK2-PH12-R00, LXK2-PH12-S00 LXK2-PL12-P00, LXK2-PL12-Q00, LXK2-PL12-R00 Source: www.luxeon.com KINGBRIGHT: KA-3528ASYC Source: www.kingbright.com
MOT_A MOT_B = pinhead:PINHD-1X1: PIN HEADER
Q1 Q2 = transistor-small-signal:BSS123: N-CHANNEL MOS FET
R1-R168 = rcl:R-EU_: RESISTOR, European symbol
S1 S2 = switch-dil:219-08*: Surface Mount DIP Switch Series 219 SMT CTS Electronic Components Sourc: www.ctscorp.com; OC_FARNELL: unknown; OC_NEWARK: unknown
SV1 SV3 = con-lsta:FE10-2: FEMALE HEADER; OC_FARNELL: unknown; OC_NEWARK: unknown
SV2 SV4 SV7 = con-lsta:FE06-2: FEMALE HEADER; OC_FARNELL: unknown; OC_NEWARK: unknown
SV5 SV6 = con-lsta:FE08-1: FEMALE HEADER; OC_FARNELL: unknown; OC_NEWARK: unknown
U1 = SparkFun-Boards:ARDUINO_SHIELD: Arduino shield footprint
U$1 U$6 = con-lsta:FE16-3
U$2 U$5 = con-lsta:FE03-1
VIN = pinhead:PINHD-1X2: PIN HEADER
X1 = con-phoenix-508:MKDSN1,5/2-5,08: MKDSN 1,5/ 2-5,08 Printklemme Nennstrom: 13,5 A Nennspannung: 250 V Rastermaß: 5,08 mm Polzahl: 2 Anschlussart: Schraubanschluss Montage: Löten Anschlussrichtung Leiter/Platine: 0 ° Artikelnummer: 1729128 Source: http://eshop.phoenixcontact.com .. 1729128.pdf